# EAGLE schematic bargraph (EAGLE 6.6.0)
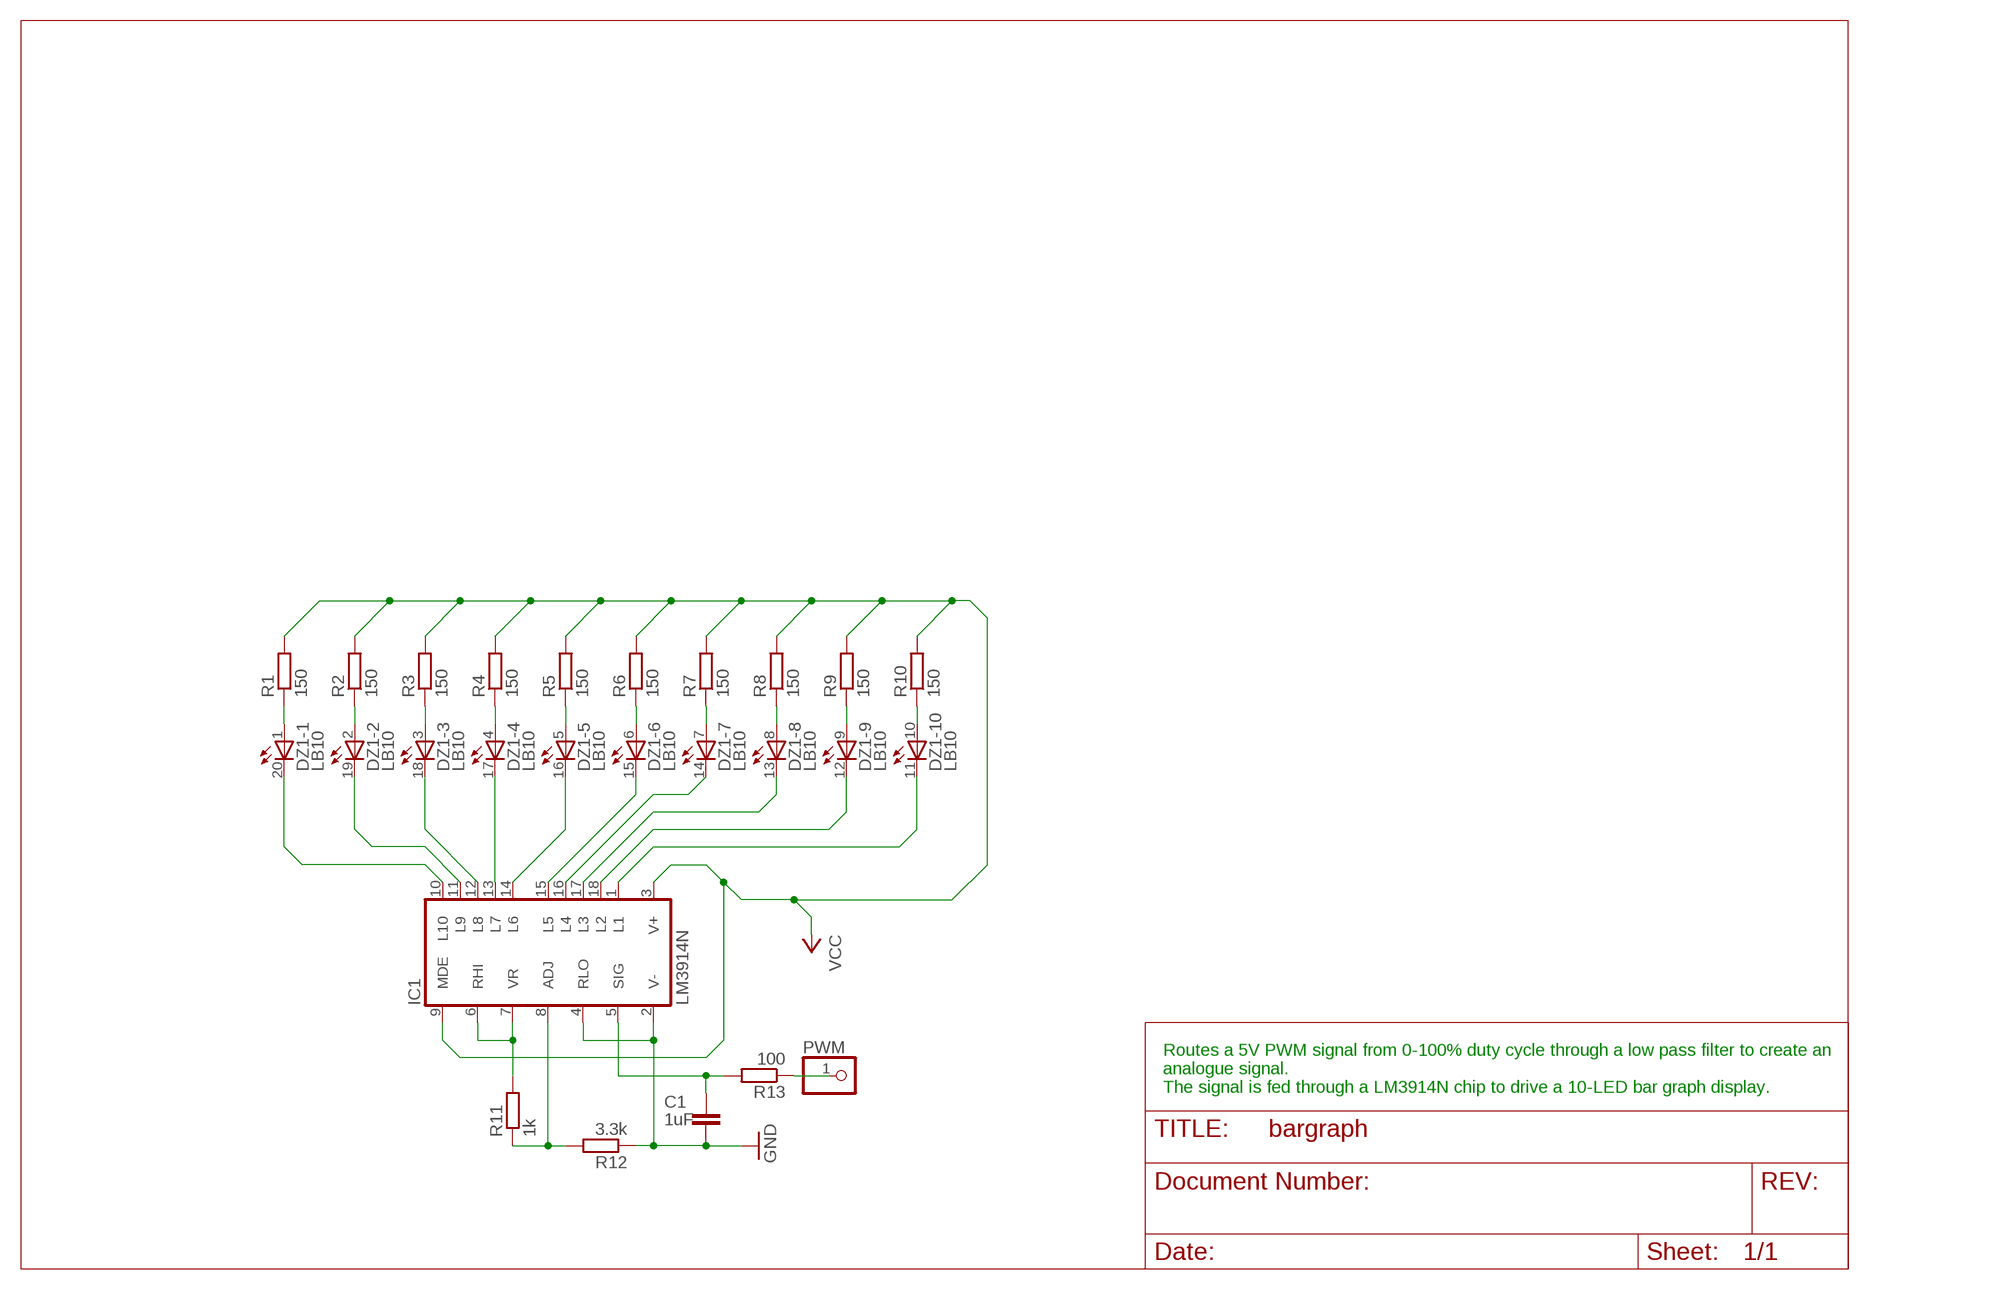
[diagram p0: schematic, sheet 1]

## Parts
C1  1uF  C-EU050-024X044  [C050-024X044]
DZ1  LB10  [LB10]
IC1  LM3914N  [DIL18]
PWM  PINHD-1X1  [1X01]
R1  150  R-EU_0207/10  [0207/10]
R2  150  R-EU_0207/10  [0207/10]
R3  150  R-EU_0207/10  [0207/10]
R4  150  R-EU_0207/10  [0207/10]
R5  150  R-EU_0207/10  [0207/10]
R6  150  R-EU_0207/10  [0207/10]
R7  150  R-EU_0207/10  [0207/10]
R8  150  R-EU_0207/10  [0207/10]
R9  150  R-EU_0207/10  [0207/10]
R10  150  R-EU_0207/10  [0207/10]
R11  1k  R-EU_0207/10  [0207/10]
R12  3.3k  R-EU_0207/10  [0207/10]
R13  100  R-EU_0207/10  [0207/10]

## Nets
GND: C1.2 IC1.2(V-) IC1.4(RLO) R12.1
N$1: DZ1.1(-1:A) R1.1
N$2: DZ1.2(-2:A) R2.1
N$3: DZ1.3(-3:A) R3.1
N$4: DZ1.4(-4:A) R4.1
N$5: DZ1.5(-5:A) R5.1
N$6: DZ1.6(-6:A) R6.1
N$7: DZ1.7(-7:A) R7.1
N$8: DZ1.8(-8:A) R8.1
N$9: DZ1.9(-9:A) R9.1
N$10: DZ1.10(-10:A) R10.1
N$11: DZ1.20(-1:C) IC1.10(L10)
N$12: DZ1.19(-2:C) IC1.11(L9)
N$13: DZ1.18(-3:C) IC1.12(L8)
N$14: DZ1.17(-4:C) IC1.13(L7)
N$15: DZ1.11(-10:C) IC1.1(L1)
N$16: DZ1.12(-9:C) IC1.18(L2)
N$17: DZ1.13(-8:C) IC1.17(L3)
N$18: DZ1.14(-7:C) IC1.16(L4)
N$19: DZ1.15(-6:C) IC1.15(L5)
N$20: DZ1.16(-5:C) IC1.14(L6)
N$21: IC1.6(RHI) IC1.7(VR) R11.2
N$22: IC1.8(ADJ) R11.1 R12.2
N$23: C1.1 IC1.5(SIG) R13.2
N$24: PWM.1 R13.1
VCC: IC1.3(V+) IC1.9(MDE) R1.2 R2.2 R3.2 R4.2 R5.2 R6.2 R7.2 R8.2 R9.2 R10.2

## Notes on the sheet
- Routes a 5V PWM signal from 0-100% duty cycle through a low pass filter to create an 
  analogue signal.
  The signal is fed through a LM3914N chip to drive a 10-LED bar graph display.

## Library data of the parts
C1 = rcl:C-EU: CAPACITOR, European symbol
DZ1 = led:LB10: LED BLOCK 10-LED bar graph, DIL, Siemens
IC1 = linear:LM3914N: LED DRIVER senses analog voltage levels and drives 10 LEDs
PWM = pinhead:PINHD-1X1: PIN HEADER
R1-R13 = rcl:R-EU_: RESISTOR, European symbol